# Altium project x-IMU3-SA-Haptic.PrjPcb
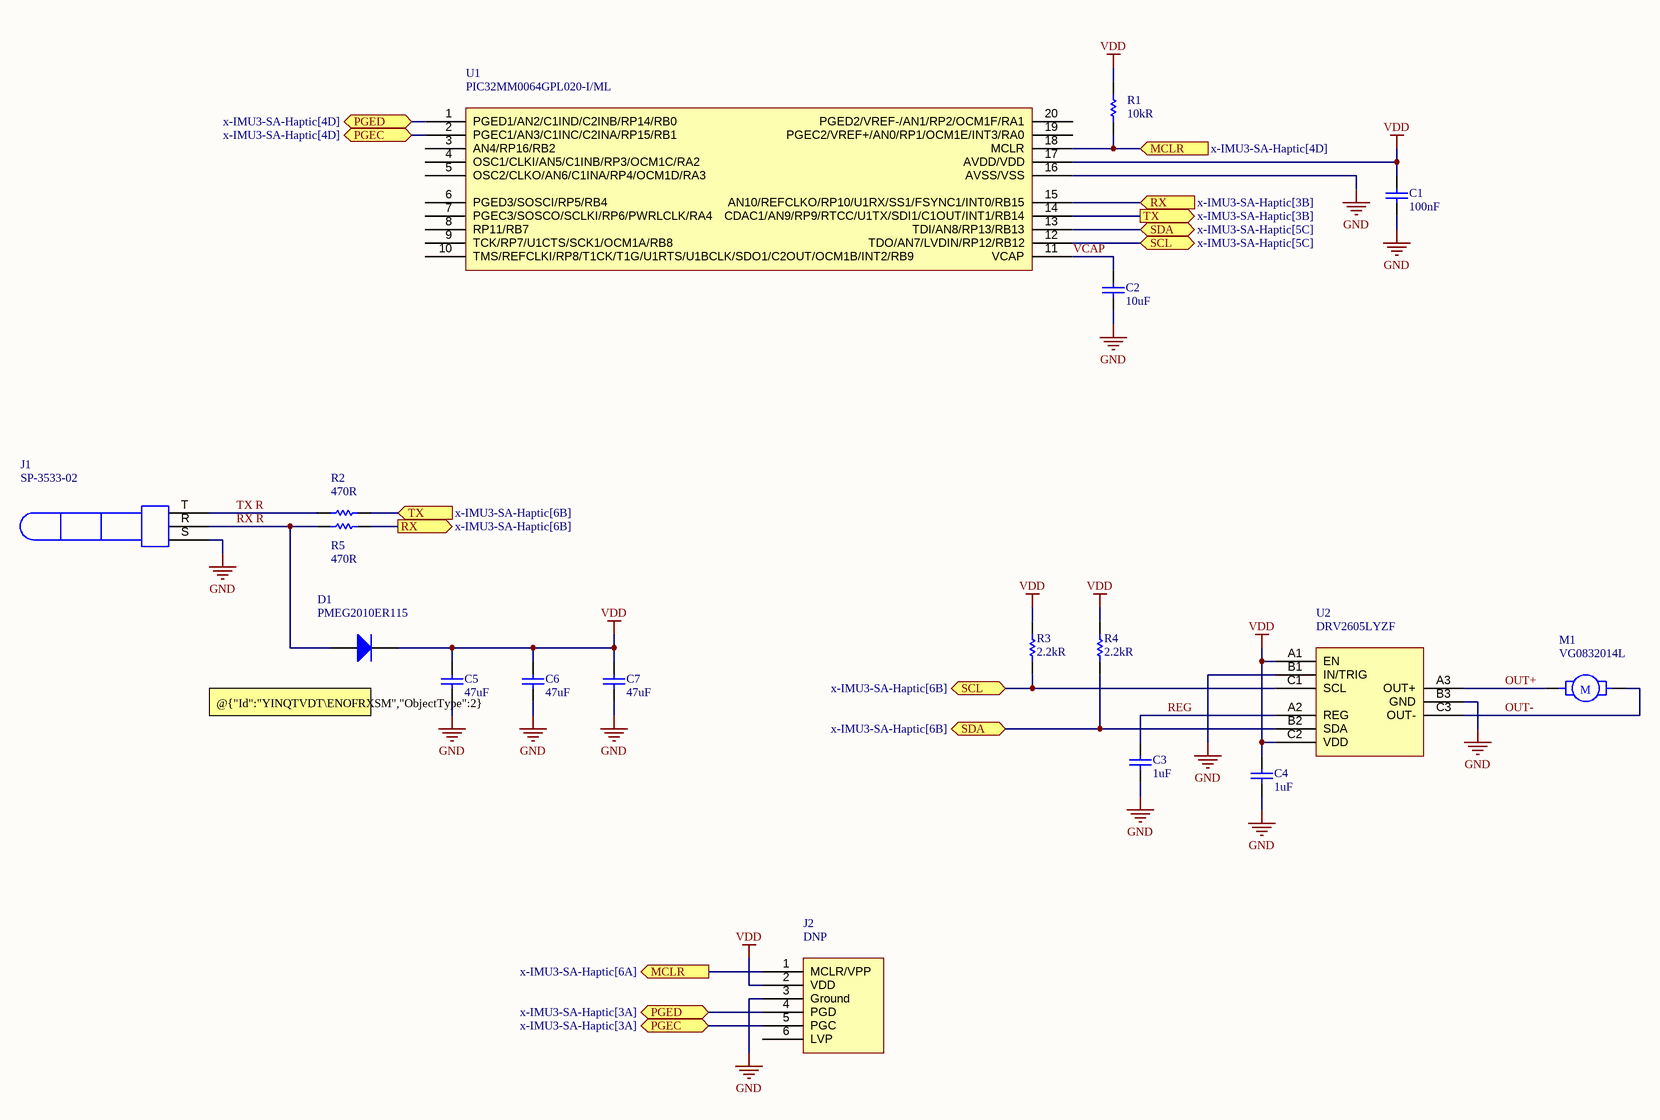
[diagram p0: x-IMU3-SA-Haptic.SchDoc]
Author: Seb Madgwick; Project: x-IMU3-SA-Haptic; Version: v1.0.0
1 sheet, 18 parts. Net scope: flat (ports and power ports of the same name join across sheets).
Board file: x-IMU3-SA-Haptic.PcbDoc

## Sheet x-IMU3-SA-Haptic.SchDoc
size A3; SheetNumber: 1; SheetTotal: 1

### Parts
C1  100nF  [Capacitor 0402]
C2  10uF  [Capacitor 0402]
C3  1uF  [Capacitor 0402]
C4  1uF  [Capacitor 0402]
C5  47uF  [Capacitor 0805]
C6  47uF  [Capacitor 0805]
C7  47uF  [Capacitor 0805]
D1  PMEG2010ER115  [SOD-123]
J1  SP-3533-02  [SP-3533-02]
J2  DNP  [Tag Connect No Legs]
M1  VG0832014L  [VG0832014L]
R1  10kR  [Resistor 0402]
R2  470R  [Resistor 0402]
R3  2.2kR  [Resistor 0402]
R4  2.2kR  [Resistor 0402]
R5  470R  [Resistor 0402]
U1  PIC32MM0064GPL020-I/ML  [QFN-20]
U2  DRV2605LYZF  [DRV2605LYZF]

### Ports
MCLR (in, see x-IMU3-SA-Haptic[4D]), MCLR (out, see x-IMU3-SA-Haptic[6A]), PGEC (bidir, see x-IMU3-SA-Haptic[3A]), PGEC (bidir, see x-IMU3-SA-Haptic[4D]), PGED (bidir, see x-IMU3-SA-Haptic[3A]), PGED (bidir, see x-IMU3-SA-Haptic[4D]), RX (in, see x-IMU3-SA-Haptic[3B]), RX (out, see x-IMU3-SA-Haptic[6B]), SCL (bidir, see x-IMU3-SA-Haptic[5C]), SCL (bidir, see x-IMU3-SA-Haptic[6B]), SDA (bidir, see x-IMU3-SA-Haptic[5C]), SDA (bidir, see x-IMU3-SA-Haptic[6B]), TX (in, see x-IMU3-SA-Haptic[6B]), TX (out, see x-IMU3-SA-Haptic[3B])

### Nets
GND: C1.1 C2.1 C3.1 C4.1 C5.1 C6.1 C7.1 J1.S J2.3(Ground) U1.16(AVSS/VSS) U2.B1(IN/TRIG) U2.B3(GND)
VDD: C1.2 C4.2 C5.2 C6.2 C7.2 D1.K J2.2(VDD) R1.2 R3.2 R4.2 U1.17(AVDD/VDD) U2.A1(EN) U2.C2(VDD)
MCLR: J2.1(MCLR/VPP) R1.1 U1.18(MCLR) ; port MCLR
OUT+: M1.2 U2.A3(OUT+)
OUT-: M1.1 U2.C3(OUT-)
PGEC: J2.5(PGC) U1.2(PGEC1/AN3/C1INC/C2INA/RP15/RB1) ; port PGEC
PGED: J2.4(PGD) U1.1(PGED1/AN2/C1IND/C2INB/RP14/RB0) ; port PGED
REG: C3.2 U2.A2(REG)
RX: R5.2 U1.15(AN10/REFCLKO/RP10/U1RX/SS1/FSYNC1/INT0/RB15) ; port RX
RX R: D1.A J1.R R5.1
SCL: R3.1 U1.12(TDO/AN7/LVDIN/RP12/RB12) U2.C1(SCL) ; port SCL
SDA: R4.1 U1.13(TDI/AN8/RP13/RB13) U2.B2(SDA) ; port SDA
TX: R2.2 U1.14(CDAC1/AN9/RP9/RTCC/U1TX/SDI1/C1OUT/INT1/RB14) ; port TX
TX R: J1.T R2.1
VCAP: C2.2 U1.11(VCAP)

Not connected (* = marked no-connect by the designer): J2 6(LVP); U1 3(AN4/RP16/RB2) 4(OSC1/CLKI/AN5/C1INB/RP3/OCM1C/RA2) 5(OSC2/CLKO/AN6/C1INA/RP4/OCM1D/RA3) 6(PGED3/SOSCI/RP5/RB4) 7(PGEC3/SOSCO/SCLKI/RP6/PWRLCLK/RA4) 8(RP11/RB7) 9(TCK/RP7/U1CTS/SCK1/OCM1A/RB8) 10(TMS/REFCLKI/RP8/T1CK/T1G/U1RTS/U1BCLK/SDO1/C2OUT/OCM1B/INT2/RB9) 19(PGEC2/VREF+/AN0/RP1/OCM1E/INT3/RA0) 20(PGED2/VREF-/AN1/RP2/OCM1F/RA1)

### Notes on the sheet
- (near D1) @{"Id":"YINQTVDT\ENOFRXSM","ObjectType":2} VF = 310mA at 1A
- TITLE
- SIZE
- A3
- VARIANT
- PROJECT
- SHEET
- VERSION
- OF
- AUTHOR
- DATE
- (in symbol VG0832014L) M

### Library data of the parts
C1-C7 = Capacitor
D1 = Diode
J2 = MPLAB ICSP
R1-R5 = Resistor